# EAGLE schematic master-control (EAGLE 6.4)

## Sheet 1 of 3
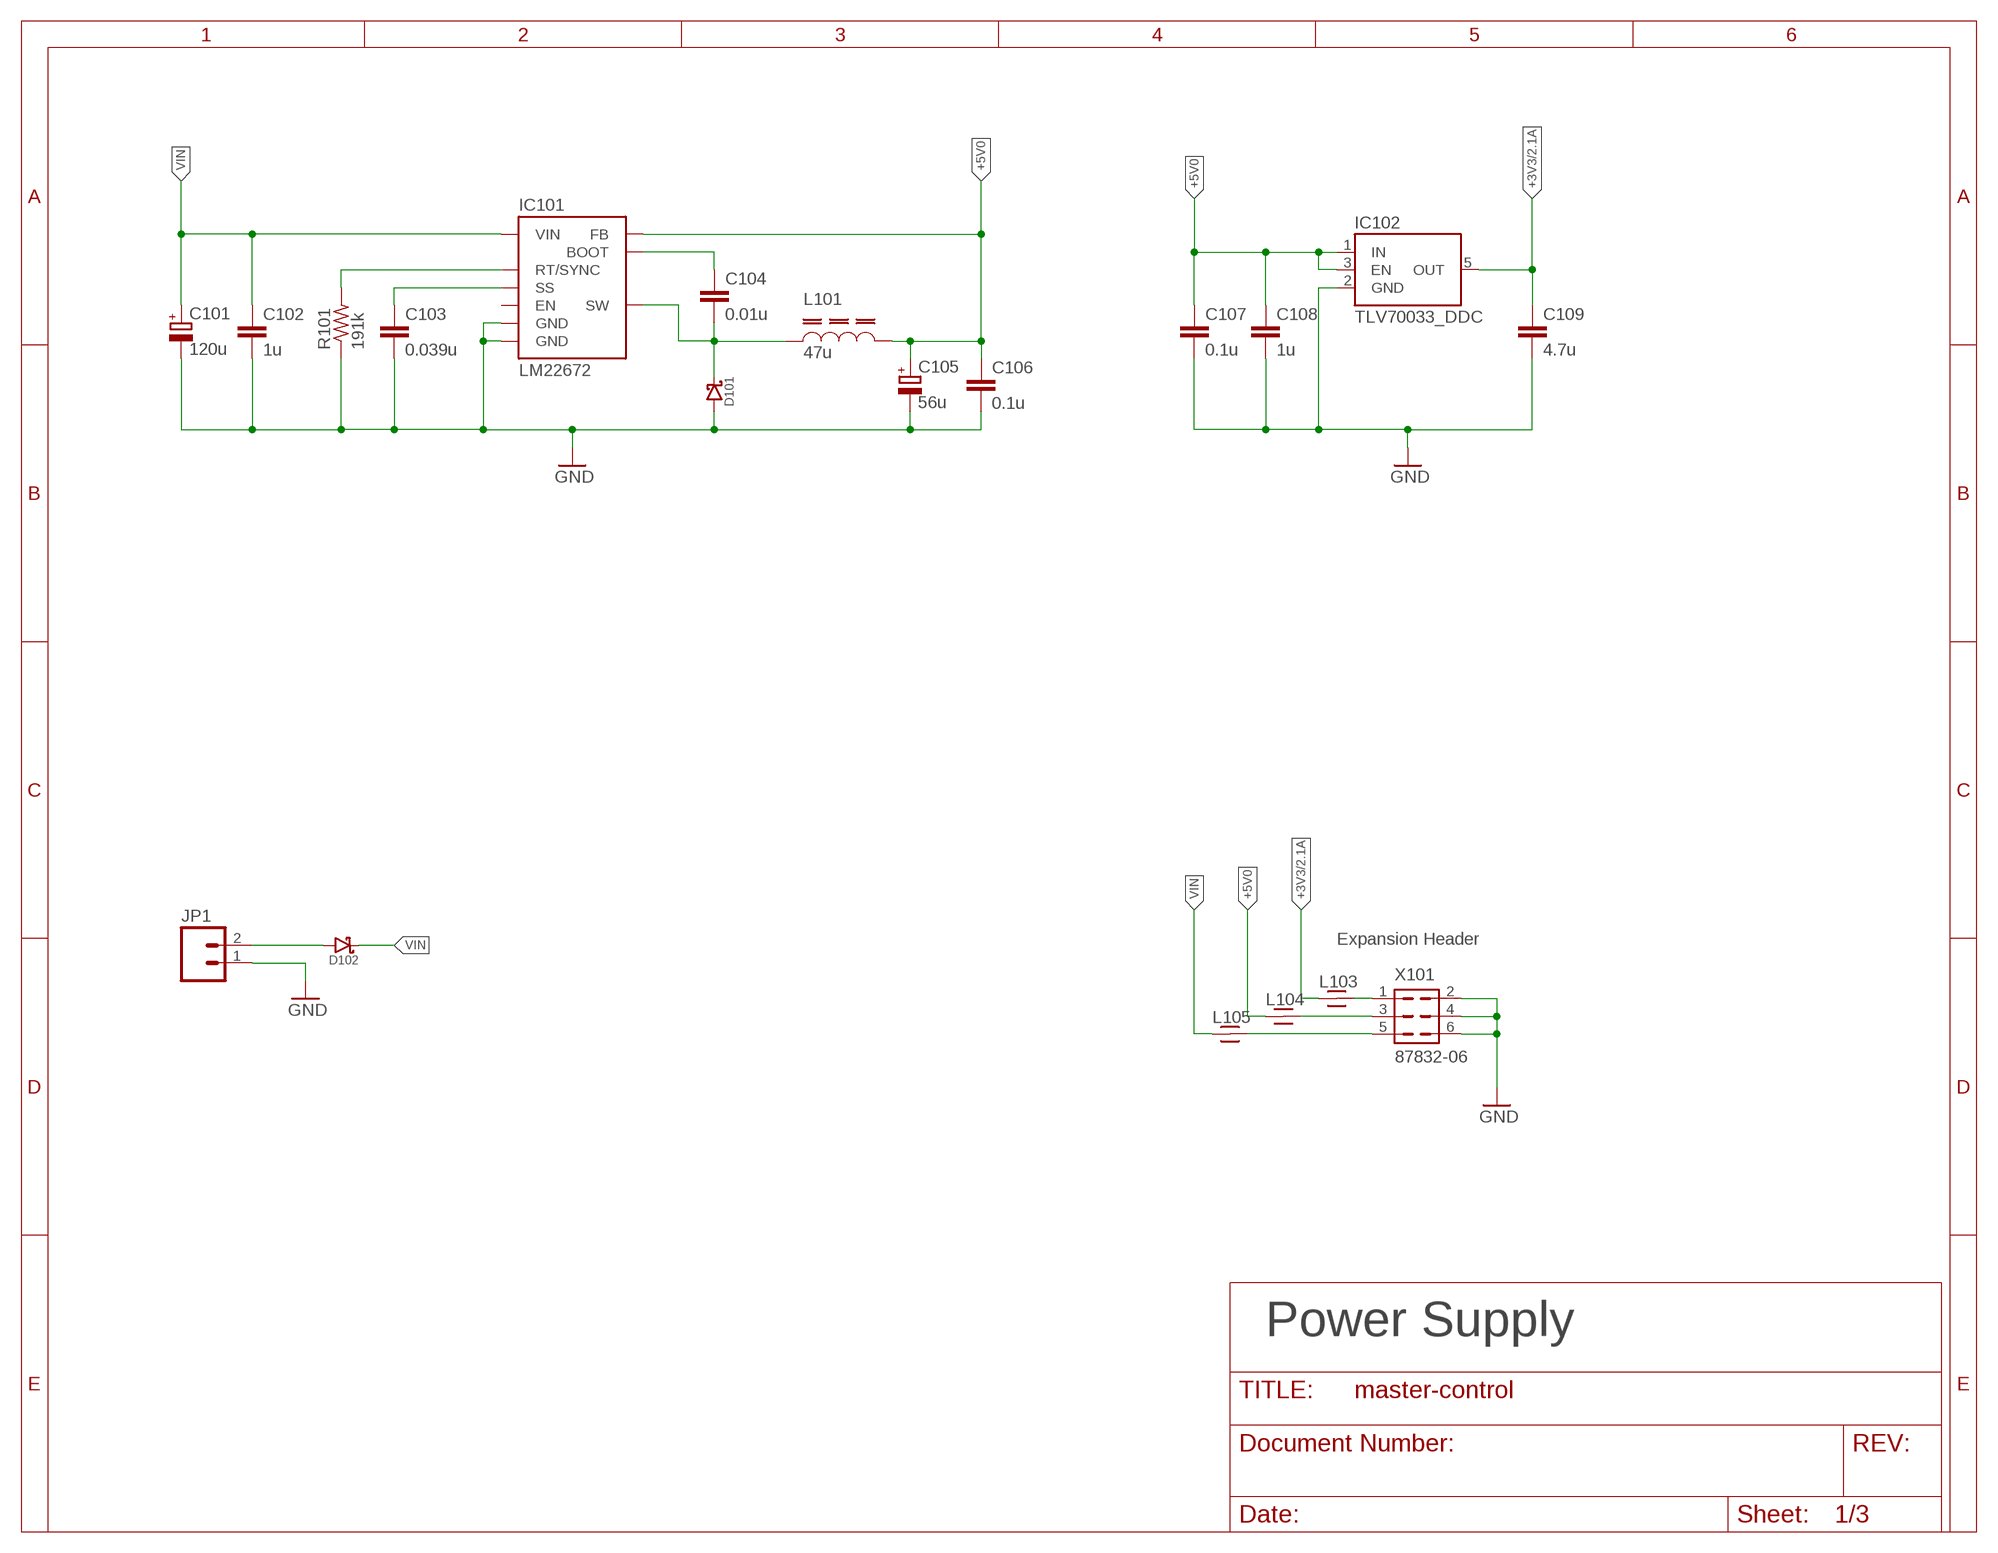
[diagram p0: schematic, sheet 1]

### Parts
C101  120u  CPOL-EUE2.5-6  [E2,5-6]
C102  1u  C-EUC0603  [C0603]
C103  0.039u  C-EUC0603  [C0603]
C104  0.01u  C-EUC0603  [C0603]
C105  56u  CPOL-EUE2.5-6  [E2,5-6]
C106  0.1u  C-EUC0603  [C0603]
C107  0.1u  C-EUC0603  [C0603]
C108  1u  C-EUC0603  [C0603]
C109  4.7u  C-EUC0603  [C0603]
D101  PMEG3050BEP  [SOD128]
D102  PMEG3050BEP  [SOD128]
IC101  LM22672  LM22672MR  [PSOP-8]
IC102  TLV70033_DDC  TLV700XX_DDC  [SOT23-5]
JP1  M025MM  [SCREWTERMINAL-5MM-2]
L101  47u  COILTRONICS-DR127-SERIES  [COILTRONICS-DR-127-SERIES]
L103  SMD_CHIP_BEAD0805  [L2012C]
L104  SMD_CHIP_BEAD0805  [L2012C]
L105  SMD_CHIP_BEAD0805  [L2012C]
R101  191k  R-US_R0603  [R0603]
X101  87832-06  [87832-06]

### Nets
+3V3: C109.1 IC102.5(OUT) L103.1 ; also sheet 2,3
+5V0: C105.+ C106.1 C107.1 C108.1 IC101.4(FB) IC102.1(IN) IC102.3(EN) L101.P$2 L104.1
GND: C101.- C102.2 C103.2 C105.- C106.2 C107.2 C108.2 C109.2 D101.ANODE IC101.6(GND) IC101.PAD(GND) IC102.2(GND) JP1.1 R101.1 X101.2 X101.4 X101.6 ; also sheet 2,3
N$1: IC101.3(RT/SYNC) R101.2
N$2: C103.1 IC101.2(SS)
N$3: D102.ANODE JP1.2
N$5: C104.2 D101.CATHODE IC101.8(SW) L101.P$1
N$6: C104.1 IC101.1(BOOT)
N$18: L103.2 X101.1
N$19: L104.2 X101.3
N$20: L105.2 X101.5
VIN: C101.+ C102.1 D102.CATHODE IC101.7(VIN) L105.1
Unconnected: IC101.5(EN)

### Notes on the sheet
- Expansion Header
- Power Supply

## Sheet 2 of 3
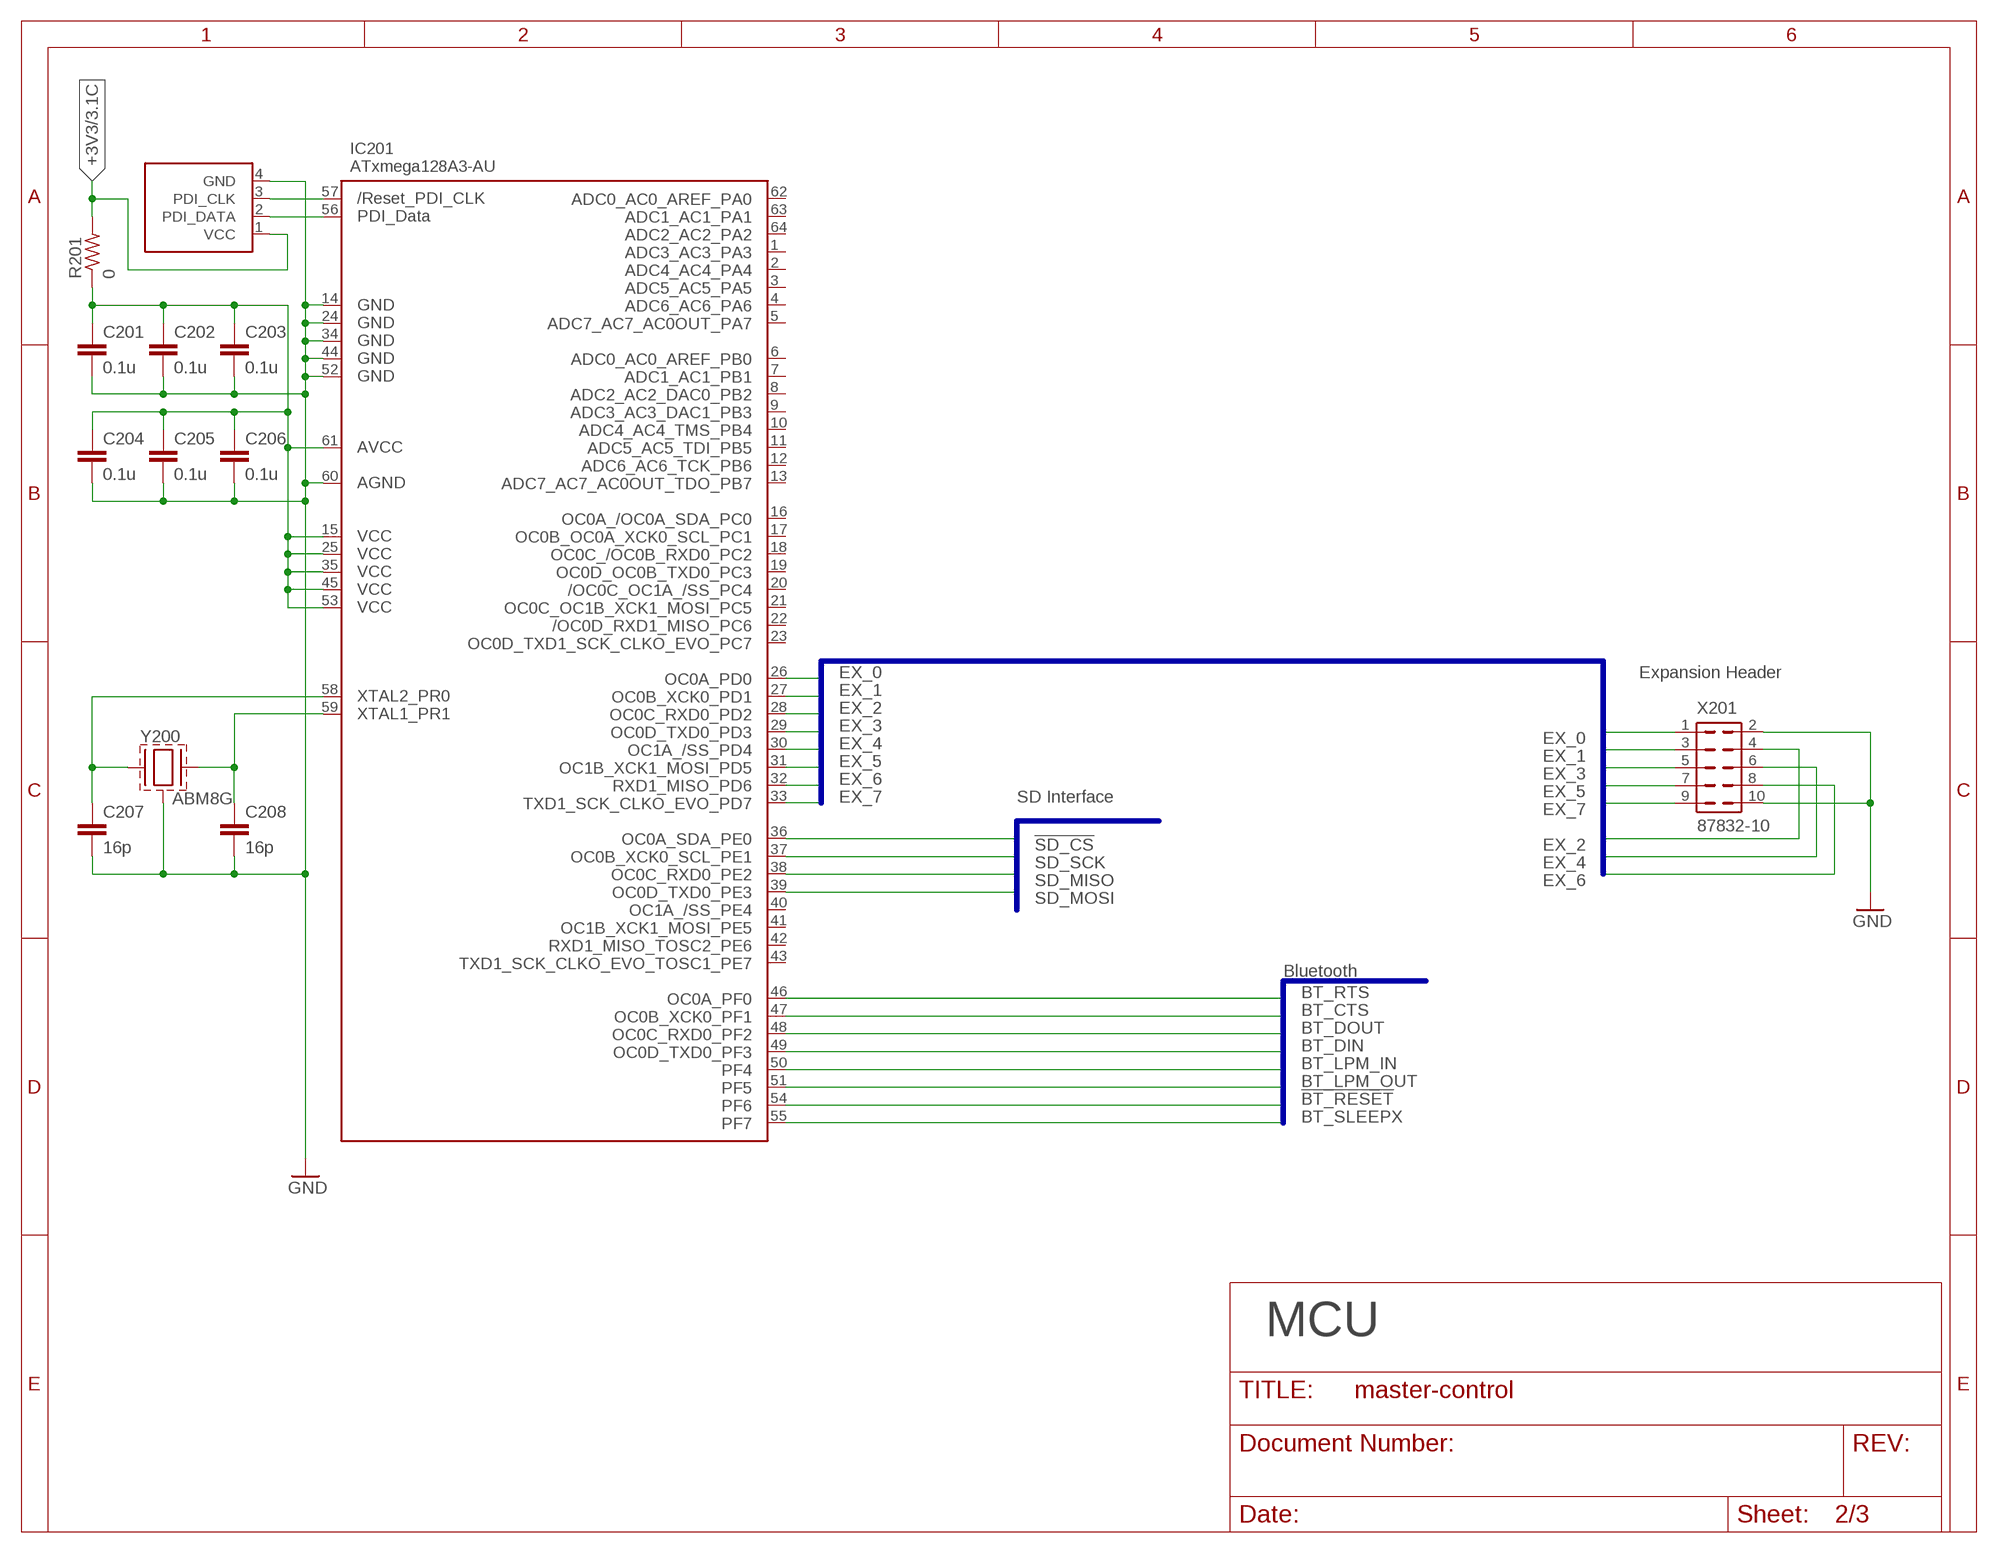
[diagram p1: schematic, sheet 2]

### Parts
C201  0.1u  C-EUC0603  [C0603]
C202  0.1u  C-EUC0603  [C0603]
C203  0.1u  C-EUC0603  [C0603]
C204  0.1u  C-EUC0603  [C0603]
C205  0.1u  C-EUC0603  [C0603]
C206  0.1u  C-EUC0603  [C0603]
C207  16p  C-EUC0603  [C0603]
C208  16p  C-EUC0603  [C0603]
IC201  ATxmega128A3-AU  AVR_XMEGA_A3_  [TQFP64]
PDI201  AVR_PDIPICOBLADE  [MOLEX_53047-0410]
R201  0  R-US_R0603  [R0603]
X201  87832-10  [87832-10]
Y200  ABM8G  [ABM8G_SMD_CRYSTAL]

### Nets
!BT_RESET: IC201.54(PF6) ; also sheet 3
!SD_CS: IC201.36(PE0) ; also sheet 3
+3V3: PDI201.1(VCC) R201.2 ; also sheet 1,3
BT_CTS: IC201.47(PF1) ; also sheet 3
BT_DIN: IC201.49(PF3) ; also sheet 3
BT_DOUT: IC201.48(PF2) ; also sheet 3
BT_LPM_IN: IC201.50(PF4) ; also sheet 3
BT_LPM_OUT: IC201.51(PF5) ; also sheet 3
BT_RTS: IC201.46(PF0) ; also sheet 3
BT_SLEEPX: IC201.55(PF7) ; also sheet 3
EX_0: IC201.26(PD0) X201.1
EX_1: IC201.27(PD1) X201.3
EX_2: IC201.28(PD2) X201.4
EX_3: IC201.29(PD3) X201.5
EX_4: IC201.30(PD4) X201.6
EX_5: IC201.31(PD5) X201.7
EX_6: IC201.32(PD6) X201.8
EX_7: IC201.33(PD7) X201.9
GND: C201.2 C202.2 C203.2 C204.2 C205.2 C206.2 C207.2 C208.2 IC201.14(GND1) IC201.24(GND2) IC201.34(GND3) IC201.44(GND4) IC201.52(GND5) IC201.60(AGND) PDI201.4(GND) X201.2 X201.10 Y200.2(CASE) Y200.4(CASE) ; also sheet 1,3
N$26: IC201.57(RESET) PDI201.3(PDI_CLK)
N$27: IC201.56(PDI_DATA) PDI201.2(PDI_DATA)
N$29: C201.1 C202.1 C203.1 C204.1 C205.1 C206.1 IC201.15(VCC1) IC201.25(VCC2) IC201.35(VCC3) IC201.45(VCC4) IC201.53(VCC5) IC201.61(AVCC) R201.1
N$32: C208.1 IC201.59(PR1) Y200.3(XT2)
N$33: C207.1 IC201.58(PR0) Y200.1(XT1)
SD_MISO: IC201.38(PE2) ; also sheet 3
SD_MOSI: IC201.39(PE3) ; also sheet 3
SD_SCK: IC201.37(PE1) ; also sheet 3
Unconnected: IC201.1(PA3) IC201.2(PA4) IC201.3(PA5) IC201.4(PA6) IC201.5(PA7) IC201.6(PB0) IC201.7(PB1) IC201.8(PB2) IC201.9(PB3) IC201.10(PB4) IC201.11(PB5) IC201.12(PB6) IC201.13(PB7) IC201.16(PC0) IC201.17(PC1) IC201.18(PC2) IC201.19(PC3) IC201.20(PC4) IC201.21(PC5) IC201.22(PC6) IC201.23(PC7) IC201.40(PE4) IC201.41(PE5) IC201.42(PE6) IC201.43(PE7) IC201.62(PA0) IC201.63(PA1) IC201.64(PA2)

### Buses
!BT_RESET,BT_LPM_OUT,BT_LPM_IN,BT_DOUT,BT_DIN,BT_RTS,BT_CTS,BT_SLEEPX
!SD_CS,SD_MISO,SD_MOSI,SD_SCK
EX_0,EX_1,EX_2,EX_3,EX_4,EX_5,EX_6,EX_7

### Notes on the sheet
- Expansion Header
- SD Interface
- Bluetooth
- MCU

## Sheet 3 of 3
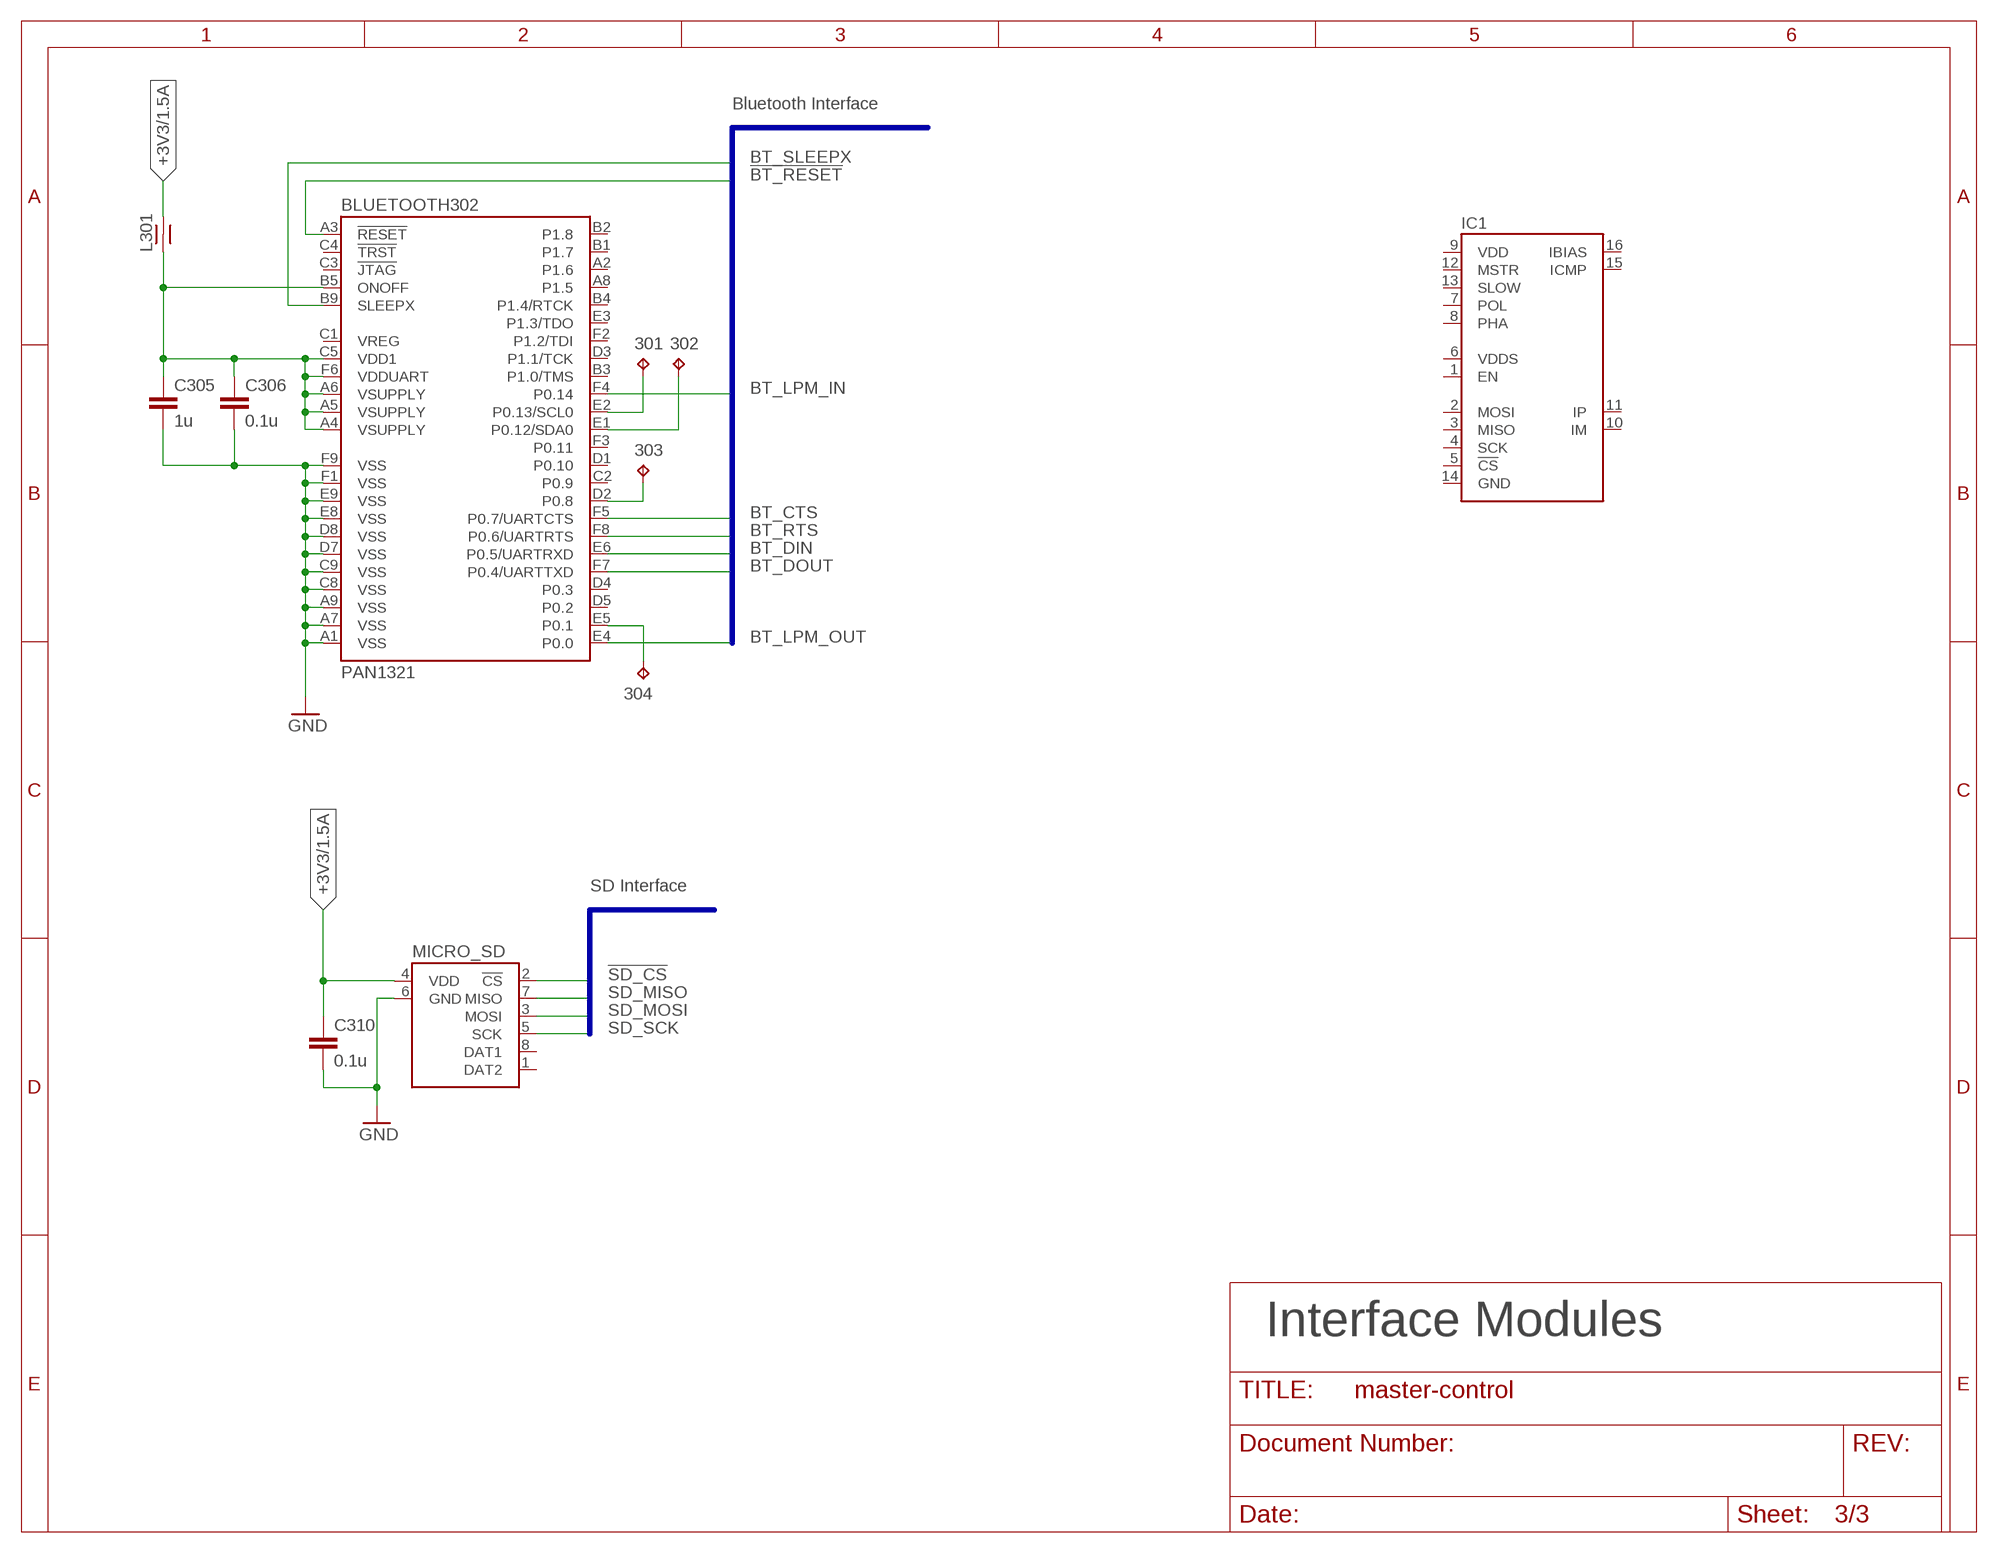
[diagram p2: schematic, sheet 3]

### Parts
301  TPTP10R  [TP10R]
302  TPTP10R  [TP10R]
303  TPTP10R  [TP10R]
304  TPTP10R  [TP10R]
BLUETOOTH302  PAN1321  PAN1321-SPPSOLDERHOLE  [PAN1321_SOLDERHOLE]
C305  1u  C-EUC0603  [C0603]
C306  0.1u  C-EUC0603  [C0603]
C310  0.1u  C-EUC0603  [C0603]
IC1  LTC6820_MS  [TSSOP16]
L301  SMD_CHIP_BEAD0805  [L2012C]
MICRO_SD  MICRO_SD3M_2900  [3M_2900_MICROSD]

### Nets
!BT_RESET: BLUETOOTH302.A3(!RESET) ; also sheet 2
!SD_CS: MICRO_SD.2(!CS) ; also sheet 2
+3V3: C310.1 L301.2 MICRO_SD.4(VDD) ; also sheet 1,2
BT_CTS: BLUETOOTH302.F5(P0.7/UARTCTS) ; also sheet 2
BT_DIN: BLUETOOTH302.E6(P0.5/UARTRXD) ; also sheet 2
BT_DOUT: BLUETOOTH302.F7(P0.4/UARTTXD) ; also sheet 2
BT_LPM_IN: BLUETOOTH302.F4(P0.14) ; also sheet 2
BT_LPM_OUT: BLUETOOTH302.E4(P0.0) ; also sheet 2
BT_RTS: BLUETOOTH302.F8(P0.6/UARTRTS) ; also sheet 2
BT_SLEEPX: BLUETOOTH302.B9(SLEEPX) ; also sheet 2
GND: BLUETOOTH302.A1(VSS) BLUETOOTH302.A7(VSS) BLUETOOTH302.A9(VSS) BLUETOOTH302.C8(VSS) BLUETOOTH302.C9(VSS) BLUETOOTH302.D7(VSS) BLUETOOTH302.D8(VSS) BLUETOOTH302.E8(VSS) BLUETOOTH302.E9(VSS) BLUETOOTH302.F1(VSS) BLUETOOTH302.F9(VSS) C305.2 C306.2 C310.2 MICRO_SD.6(GND) ; also sheet 1,2
N$4: BLUETOOTH302.A4(VSUPPLY) BLUETOOTH302.A5(VSUPPLY) BLUETOOTH302.A6(VSUPPLY) BLUETOOTH302.B5(ONOFF) BLUETOOTH302.C5(VDD1) BLUETOOTH302.F6(VDDUART) C305.1 C306.1 L301.1
N$7: 302.TP BLUETOOTH302.E1(P0.12/SDA0)
N$8: 301.TP BLUETOOTH302.E2(P0.13/SCL0)
N$16: 304.TP BLUETOOTH302.E5(P0.1)
N$17: 303.TP BLUETOOTH302.D2(P0.8)
SD_MISO: MICRO_SD.7(MISO) ; also sheet 2
SD_MOSI: MICRO_SD.3(MOSI) ; also sheet 2
SD_SCK: MICRO_SD.5(SCK) ; also sheet 2
Unconnected: BLUETOOTH302.A2(P1.6) BLUETOOTH302.A8(P1.5) BLUETOOTH302.B1(P1.7) BLUETOOTH302.B2(P1.8) BLUETOOTH302.B3(P1.0/TMS) BLUETOOTH302.B4(P1.4/RTCK) BLUETOOTH302.C1(VREG) BLUETOOTH302.C2(P0.9) BLUETOOTH302.C3(!JTAG) BLUETOOTH302.C4(!TRST) BLUETOOTH302.D1(P0.10) BLUETOOTH302.D3(P1.1/TCK) BLUETOOTH302.D4(P0.3) BLUETOOTH302.D5(P0.2) BLUETOOTH302.E3(P1.3/TDO) BLUETOOTH302.F2(P1.2/TDI) BLUETOOTH302.F3(P0.11) IC1.1(EN) IC1.2(MOSI) IC1.3(MISO) IC1.4(SCK) IC1.5(!CS) IC1.6(VDDS) IC1.7(POL) IC1.8(PHA) IC1.9(VDD) IC1.10(IM) IC1.11(IP) IC1.12(MSTR) IC1.13(SLOW) IC1.14(GND) IC1.15(ICMP) IC1.16(IBIAS) MICRO_SD.1(DAT2) MICRO_SD.8(DAT1)

### Buses
!SD_CS,SD_MISO,SD_MOSI,SD_SCK
!BT_RESET,BT_LPM_OUT,BT_LPM_IN,BT_DOUT,BT_DIN,BT_RTS,BT_CTS,BT_SLEEPX

### Notes on the sheet
- Bluetooth Interface
- SD Interface
- Interface Modules

## Library data of the parts
301-304 = testpad:TP: Test pad
BLUETOOTH302 = m_module:PAN1321-SPP: Panasonic PAN1321-SPP Bluetooth Module Features: Complete Bluetooth 2.0 + EDR solution – Configurable for BT 1.2 Ultra low power design in 0.13 µm CMOS Temperature range from -40°C to 85°C Integrates ARM7TDMI, RAM and patchable ROM On-module voltage regulators. External supply 2.9 - 4.1 V On-module EEPROM with configuration data Reference clock included Low power clock from internal oscillator or external low power clock (e.g. 32.768 kHz) Dynamic low power mode switching Interfaces: AT command interface over UART, configurable from 9600 baud up to 3.25 MBaud General purpose I/Os with interrupt capabilities. JTAG for boundary scan and debug RF: Transmit power typ. 2.5 dBm (default settings) Receiver sensitivity typ. -86 dBm Integrated antenna switch, balun and antenna filter Integrated LNA with excellent blocking and intermodulation performance No external components except antenna Digital demodulation for optimum sensitivity and co-/adjacent channel performance Bluetooth: Bluetooth V2.0 + EDR compliant SPP Device A and B support 1 ACL link with stream or command mode SPP Device A and B - Visible while connected SPP Device A and B - Visible/connectable when not connected SPP Device A and B - Device Discovery capable after receiving OK on data transfer Sniff mode is supported with above capabilities 5 trusted devices stored in EEPROM Testing Enable DUT Crystal calibration H4 with UART HW flow control (RTS/CTS) Security modes: Modes 1 and Mode 3 Master-Slave role switch Added 11/17/2012. Manual revision 3.3; MANUF: Panasonic; PARTNUM: ENW-89811A6KF
C101 = rcl:CPOL-EU: POLARIZED CAPACITOR, European symbol; MANUF: Panasonic; PARTNUM: EEU-FR1C121
C102-C104 C106-C109 C201-C206 C305 C306 C310 = rcl:C-EU: CAPACITOR, European symbol
C105 = rcl:CPOL-EU: POLARIZED CAPACITOR, European symbol; MANUF: Panasonic; PARTNUM: EEAFC1C560
C207 C208 = rcl:C-EU: CAPACITOR, European symbol; MANUF: Murata; PARTNUM: GRM1885C1H160JA01D
D101 D102 = m_diode:PMEG3050BEP: 5 A low VF MEGA Schottky barrier rectifier Planar Maximum Efficiency General Application (MEGA) Schottky barrier rectifier with an integrated guard ring for stress protection, encapsulated in a SOD128 small and flat lead Surface-Mounted Device (SMD) SOD128 plastic package.; MANUF: NXP Semiconductors; PARTNUM: PMEG3050BEP
IC1 = m_ic-comm:LTC6820: LTC6820 isoSPI Isolated Communications Interface Linear Technologies 6820f datasheet, added 2013-05-28; MANUF: Linear Technology; PARTNUM: LTC6820IMS
IC101 = m_vreg:LM22672: LM22672 1A SIMPLE SWITCHER, Step-Down Voltage Regulator Features: Wide input voltage range: 4.5V to 42V Internally compensated voltage mode control Stable with low ESR ceramic capacitors 200 mΩ N-channel MOSFET Output voltage options: -ADJ (outputs as low as 1.285V) -5.0 (output fixed to 5V) ±1.5% feedback reference accuracy Switching frequency of 500 kHz, adjustable between 200 kHz and 1 MHz -40°C to 125°C operating junction temperature range Precision enable pin Integrated boot diode Adjustable soft-start Fully WEBENCH® enabled Step-down and inverting buck-boost applications LM22672Q is an Automotive Grade product that is AEC- Q100 grade 1 qualified (-40°C to +125°C operating junction temperature) Added 6/5/2012; MANUF: TI; PARTNUM: LM22672XMRX-XXX
IC102 = m_vreg:TLV700XX: Texas Instruments 200-mA, Low-IQ, Low-Dropout Regulator for Portable Devices The TLV700xx series of low-dropout (LDO) linear regulators are low quiescent current devices with excellent line and load transient performance. These LDOs are designed for power-sensitive applications. A precision bandgap and error amplifier provides overall 2% accuracy. Low output noise, very high power-supply rejection ratio (PSRR), and low dropout voltage make this series of devices ideal for most battery-operated handheld equipment. All device versions have thermal shutdown and current limit for safety. Furthermore, these devices are stable with an effective output capacitance of only 0.1 ?F. This feature enables the use of cost-effective capacitors that have higher bias voltages and temperature derating. The devices regulate to specified accuracy with no output load. The TLV700xx series of LDOs are available in 1,5-mm x 1,5-mm SON-6, SOT23-5, and SC-70 packages. FEATURES Very Low Dropout: 175 mV at 200 mA 2% Accuracy Low IQ: 31 ?A Available in Fixed-Output Voltages from 0.7 V to 4.8 V High PSRR: 68 dB at 1 kHz Stable with Effective Capacitance of 0.1 ?F Thermal Shutdown and Overcurrent Protection Available in 1,5-mm × 1,5-mm SON-6, SOT23-5, and SC-70 packages; MANUF: TI; PARTNUM: TLV70033DDC
IC201 = xmega:AVR_XMEGA_A3_: Device for Atmel AVR XMEGA A3 Series; MANUF: Atmel; PARTNUM: ATxmega128A3-AU
JP1 = SparkFun-Connectors:M02: Header 2 Standard 2-pin 0.1" header. Use with straight break away headers (SKU : PRT-00116), right angle break away headers (PRT-00553), swiss pins (PRT-00743), machine pins (PRT-00117), and female headers (PRT-00115). Molex polarized connector foot print use with SKU : PRT-08233 with associated crimp pins and housings.
L101 = m_inductor:COILTRONICS-DR127-SERIES: Coiltronics High Power Density, High Efficiency, Shielded Inductors Datasheet <http://www.cooperet.com/library/products/PM-4310%20DR-Series.pdf>; MANUF: Coiltronics; PARTNUM: DR125-470-R
L103-L105 = m_inductor:SMD_CHIP_BEAD: SMD Ferrite Chip Bead; MANUF: TDK; PARTNUM: MMZ2012Y121B
L301 = m_inductor:SMD_CHIP_BEAD: SMD Ferrite Chip Bead
MICRO_SD = m_connector:MICRO_SD: Card Connector microSD Added 11/19/2012, 3M TS-2197-02; MANUF: 3M; PARTNUM: 29-08-05WB-MG
PDI201 = m_connector:AVR_PDI: AVR PDI Interface Header
R101 R201 = rcl:R-US_: RESISTOR, American symbol
X101 = con-molex:87832-06: Milli-Grid Header 2.00mm (.079") Pitch; OC_FARNELL: 1756947; OC_NEWARK: unknown
X201 = con-molex:87832-10: Milli-Grid Header 2.00mm (.079") Pitch; OC_FARNELL: unknown; OC_NEWARK: unknown
Y200 = m_misc:ABM8G: Ultra Miniature Ceramic Glass Sealed SMD Crystal Added 11/20/2012; MANUF: Abracon; PARTNUM: ABM8G-16.000MHZ-18-D2Y-T